# Altium schematic sheet Sheet_1_2024-01-19.schdoc
size 372 x 307 mm
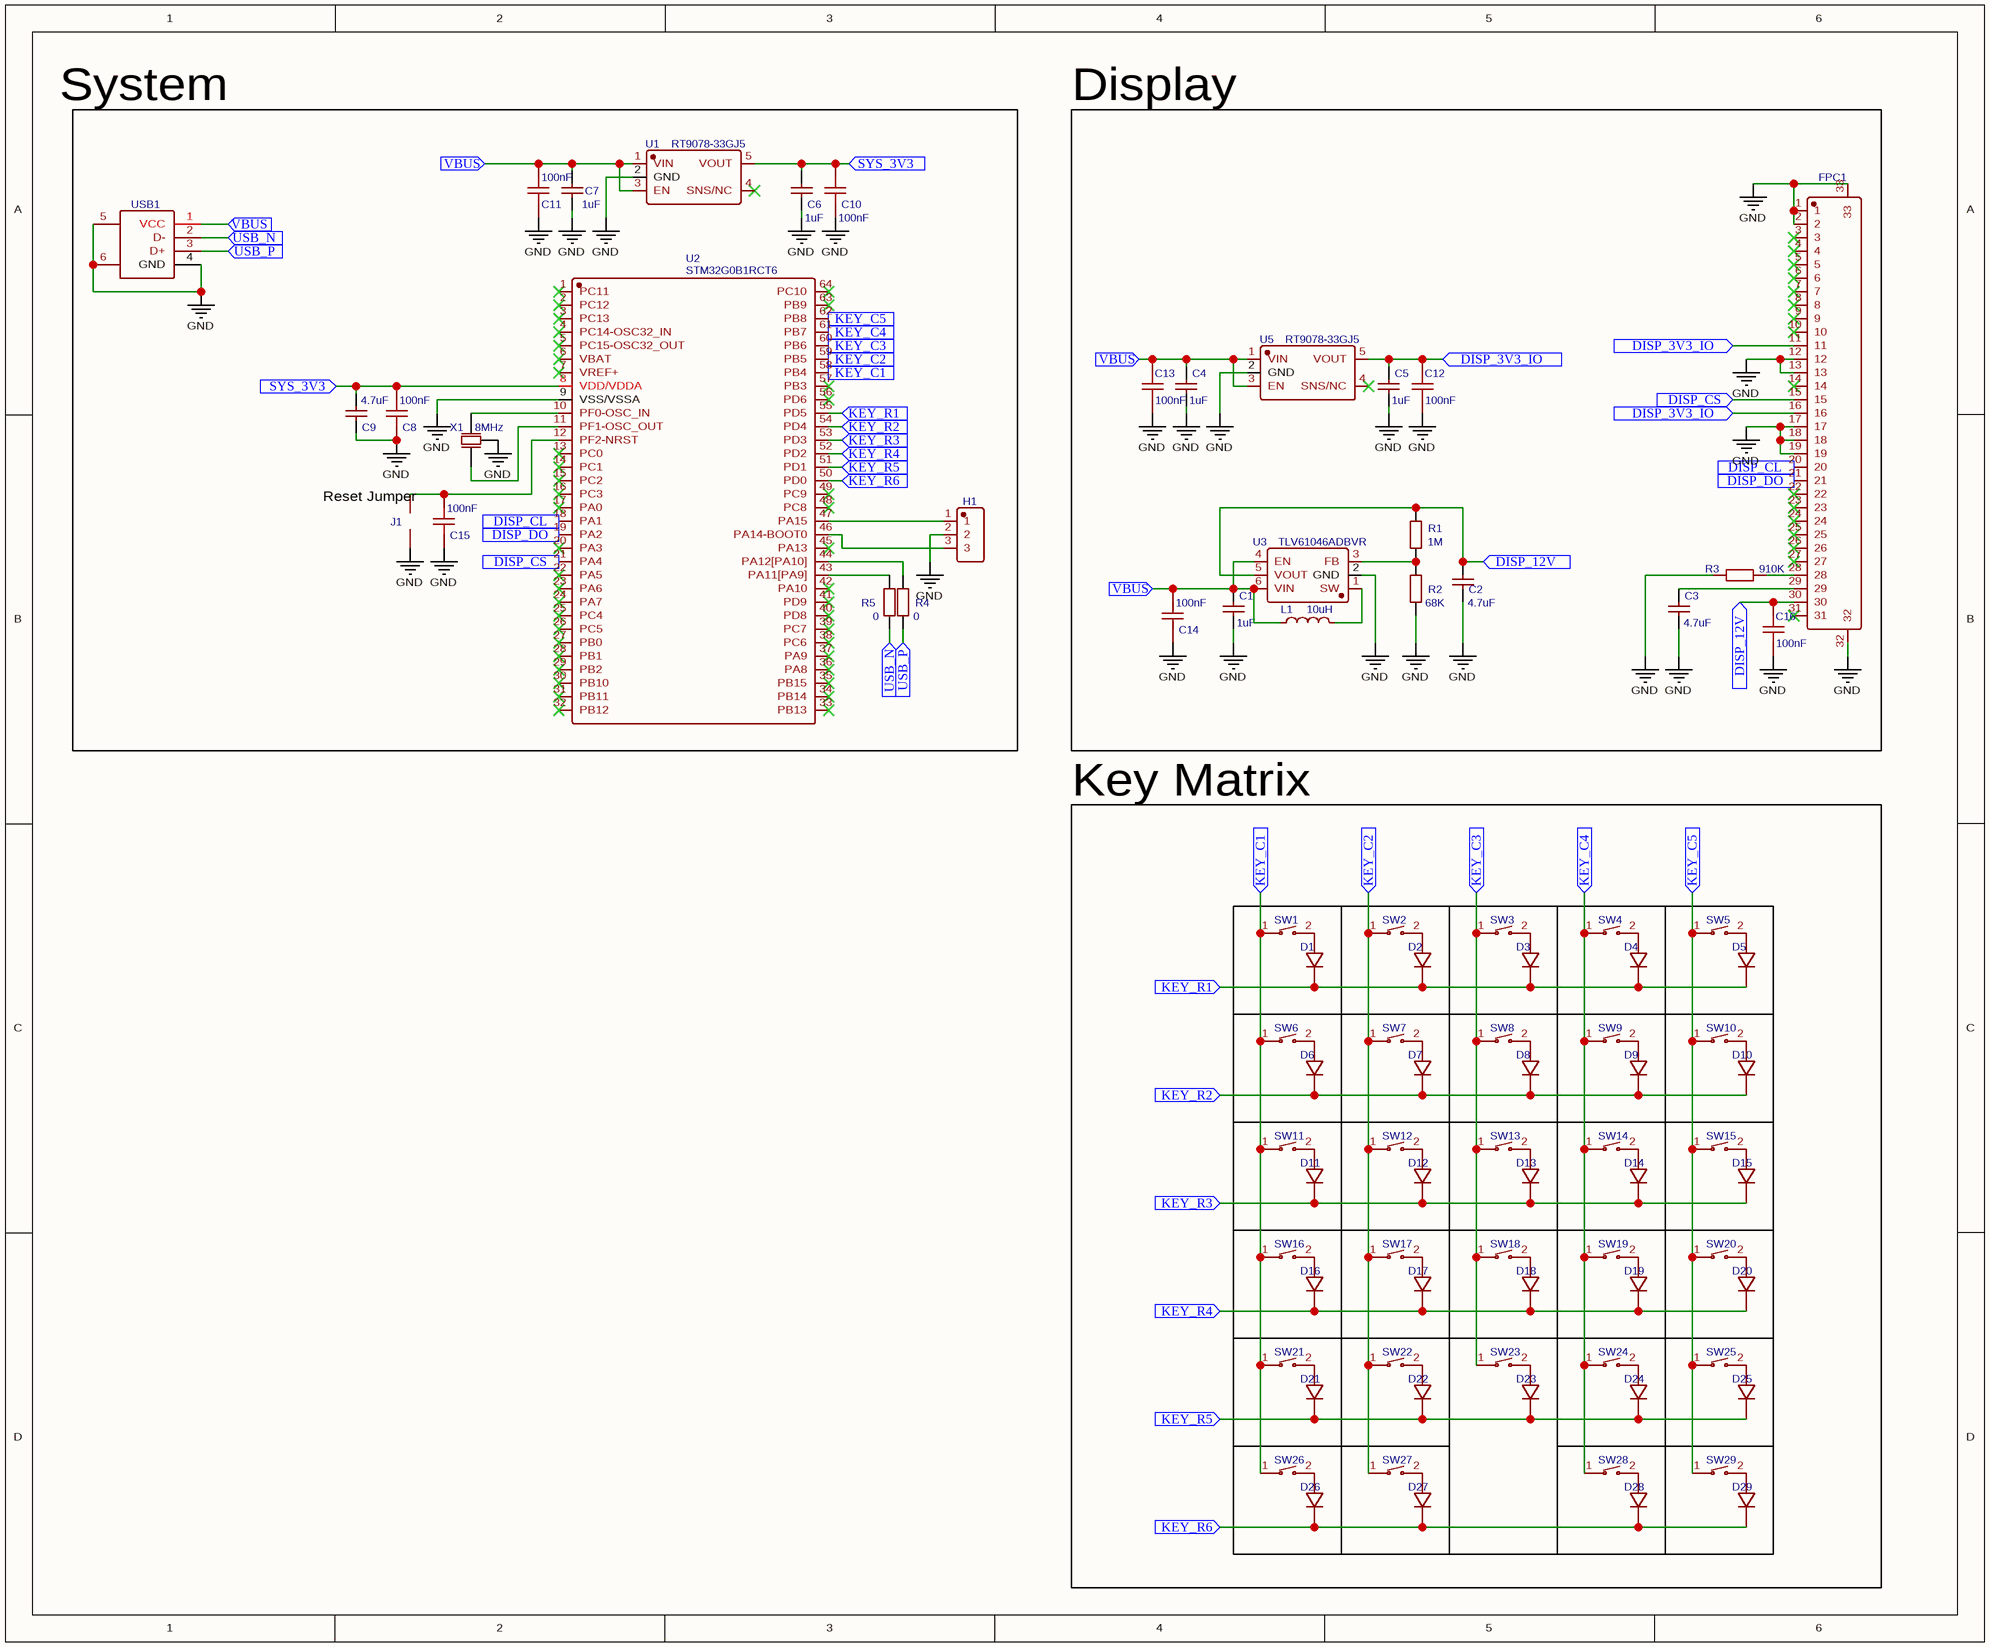
[diagram p0: Sheet_1_2024-01-19.schdoc]

## Parts
C1  1uF  [C0603]
C2  4.7uF  [C1206]
C3  4.7uF  [C1206]
C4  1uF  [C0603]
C5  1uF  [C0603]
C6  1uF  [C0603]
C7  1uF  [C0603]
C8  100nF  [C0603]
C9  4.7uF  [C1206]
C10  100nF  [C0603]
C11  100nF  [C0603]
C12  100nF  [C0603]
C13  100nF  [C0603]
C14  100nF  [C0603]
C15  100nF  [C0603]
C16  100nF  [C0603]
D1  1N4148TR-C84412  [DO-35_BD2.0-L4.2-P8.20-D0.5-RD]  (value not drawn)
D2  1N4148TR-C84412  [DO-35_BD2.0-L4.2-P8.20-D0.5-RD]  (value not drawn)
D3  1N4148TR-C84412  [DO-35_BD2.0-L4.2-P8.20-D0.5-RD]  (value not drawn)
D4  1N4148TR-C84412  [DO-35_BD2.0-L4.2-P8.20-D0.5-RD]  (value not drawn)
D5  1N4148TR-C84412  [DO-35_BD2.0-L4.2-P8.20-D0.5-RD]  (value not drawn)
D6  1N4148TR-C84412  [DO-35_BD2.0-L4.2-P8.20-D0.5-RD]  (value not drawn)
D7  1N4148TR-C84412  [DO-35_BD2.0-L4.2-P8.20-D0.5-RD]  (value not drawn)
D8  1N4148TR-C84412  [DO-35_BD2.0-L4.2-P8.20-D0.5-RD]  (value not drawn)
D9  1N4148TR-C84412  [DO-35_BD2.0-L4.2-P8.20-D0.5-RD]  (value not drawn)
D10  1N4148TR-C84412  [DO-35_BD2.0-L4.2-P8.20-D0.5-RD]  (value not drawn)
D11  1N4148TR-C84412  [DO-35_BD2.0-L4.2-P8.20-D0.5-RD]  (value not drawn)
D12  1N4148TR-C84412  [DO-35_BD2.0-L4.2-P8.20-D0.5-RD]  (value not drawn)
D13  1N4148TR-C84412  [DO-35_BD2.0-L4.2-P8.20-D0.5-RD]  (value not drawn)
D14  1N4148TR-C84412  [DO-35_BD2.0-L4.2-P8.20-D0.5-RD]  (value not drawn)
D15  1N4148TR-C84412  [DO-35_BD2.0-L4.2-P8.20-D0.5-RD]  (value not drawn)
D16  1N4148TR-C84412  [DO-35_BD2.0-L4.2-P8.20-D0.5-RD]  (value not drawn)
D17  1N4148TR-C84412  [DO-35_BD2.0-L4.2-P8.20-D0.5-RD]  (value not drawn)
D18  1N4148TR-C84412  [DO-35_BD2.0-L4.2-P8.20-D0.5-RD]  (value not drawn)
D19  1N4148TR-C84412  [DO-35_BD2.0-L4.2-P8.20-D0.5-RD]  (value not drawn)
D20  1N4148TR-C84412  [DO-35_BD2.0-L4.2-P8.20-D0.5-RD]  (value not drawn)
D21  1N4148TR-C84412  [DO-35_BD2.0-L4.2-P8.20-D0.5-RD]  (value not drawn)
D22  1N4148TR-C84412  [DO-35_BD2.0-L4.2-P8.20-D0.5-RD]  (value not drawn)
D23  1N4148TR-C84412  [DO-35_BD2.0-L4.2-P8.20-D0.5-RD]  (value not drawn)
D24  1N4148TR-C84412  [DO-35_BD2.0-L4.2-P8.20-D0.5-RD]  (value not drawn)
D25  1N4148TR-C84412  [DO-35_BD2.0-L4.2-P8.20-D0.5-RD]  (value not drawn)
D26  1N4148TR-C84412  [DO-35_BD2.0-L4.2-P8.20-D0.5-RD]  (value not drawn)
D27  1N4148TR-C84412  [DO-35_BD2.0-L4.2-P8.20-D0.5-RD]  (value not drawn)
D28  1N4148TR-C84412  [DO-35_BD2.0-L4.2-P8.20-D0.5-RD]  (value not drawn)
D29  1N4148TR-C84412  [DO-35_BD2.0-L4.2-P8.20-D0.5-RD]  (value not drawn)
FPC1  0.5K-AX-31PWB  [FPC-SMD_31P-P0.50_HDGC_0.5K-AX-31PWB]  (value not drawn)
H1  DZ254R-11-03-63  [HDR-TH_3P-P2.54-V-M]  (value not drawn)
J1  JUMPER_SOLDER_1X2  [JUMPER_SOLDER_1X2]  (value not drawn)
L1  10uH  [IND-SMD_L5.0-W5.0_LQH5BPBXX]
R1  1M  [R0603]
R2  68K  [R0603]
R3  910K  [R0603]
R4  0  [R0603]
R5  0  [R0603]
SW1  CPG151101D93  [SW-TH_CPG151101D9X]  (value not drawn)
SW2  CPG151101D93  [SW-TH_CPG151101D9X]  (value not drawn)
SW3  CPG151101D93  [SW-TH_CPG151101D9X]  (value not drawn)
SW4  CPG151101D93  [SW-TH_CPG151101D9X]  (value not drawn)
SW5  CPG151101D93  [SW-TH_CPG151101D9X]  (value not drawn)
SW6  CPG151101D93  [SW-TH_CPG151101D9X]  (value not drawn)
SW7  CPG151101D93  [SW-TH_CPG151101D9X]  (value not drawn)
SW8  CPG151101D93  [SW-TH_CPG151101D9X]  (value not drawn)
SW9  CPG151101D93  [SW-TH_CPG151101D9X]  (value not drawn)
SW10  CPG151101D93  [SW-TH_CPG151101D9X]  (value not drawn)
SW11  CPG151101D93  [SW-TH_CPG151101D9X]  (value not drawn)
SW12  CPG151101D93  [SW-TH_CPG151101D9X]  (value not drawn)
SW13  CPG151101D93  [SW-TH_CPG151101D9X]  (value not drawn)
SW14  CPG151101D93  [SW-TH_CPG151101D9X]  (value not drawn)
SW15  CPG151101D93  [SW-TH_CPG151101D9X]  (value not drawn)
SW16  CPG151101D93  [SW-TH_CPG151101D9X]  (value not drawn)
SW17  CPG151101D93  [SW-TH_CPG151101D9X]  (value not drawn)
SW18  CPG151101D93  [SW-TH_CPG151101D9X]  (value not drawn)
SW19  CPG151101D93  [SW-TH_CPG151101D9X]  (value not drawn)
SW20  CPG151101D93  [SW-TH_CPG151101D9X]  (value not drawn)
SW21  CPG151101D93  [SW-TH_CPG151101D9X]  (value not drawn)
SW22  CPG151101D93  [SW-TH_CPG151101D9X]  (value not drawn)
SW23  CPG151101D93  [SW-TH_CPG151101D9X]  (value not drawn)
SW24  CPG151101D93  [SW-TH_CPG151101D9X]  (value not drawn)
SW25  CPG151101D93  [SW-TH_CPG151101D9X]  (value not drawn)
SW26  CPG151101D93  [SW-TH_CPG151101D9X]  (value not drawn)
SW27  CPG151101D93  [SW-TH_CPG151101D9X]  (value not drawn)
SW28  CPG151101D93  [SW-TH_CPG151101D9X]  (value not drawn)
SW29  CPG151101D93  [SW-TH_CPG151101D9X]  (value not drawn)
U1  RT9078-33GJ5  [TSOT-23-5_L2.9-W1.6-P0.95-LS2.8-BR]
U2  STM32G0B1RCT6  [LQFP-64_L10.0-W10.0-P0.50-LS12.0-BL]
U3  TLV61046ADBVR  [SOT-23-6_L2.9-W1.6-P0.95-LS2.8-BL]
U5  RT9078-33GJ5  [TSOT-23-5_L2.9-W1.6-P0.95-LS2.8-BR]
USB1  U241-041N-1BR85-1  [USB-B-TH_U241-041N-1BR85-1]  (value not drawn)
X1  8MHz  [OSC-SMD_3P-L3.2-W1.3-P1.2-L]

## Blocks framed on the sheet
Reset Jumper: C6-C11 C15 H1 J1 R4 R5 U1 U2 USB1 X1
Display: C1-C5 C12-C14 C16 FPC1 L1 R1-R3 U3 U5
Key Matrix: D1-D29 SW1-SW29

## Ports
DISP_3V3_IO (in), DISP_12V (in), DISP_CL (in), DISP_CS (in), DISP_DO (in), KEY_C1 (in), KEY_C2 (in), KEY_C3 (in), KEY_C4 (in), KEY_C5 (in), KEY_R1 (in), KEY_R2 (in), KEY_R3 (in), KEY_R4 (in), KEY_R5 (in), KEY_R6 (in), SYS_3V3 (in), USB_N (in), USB_P (in), VBUS (in)

## Nets
GND: C1.1 C2.2 C3.2 C4.1 C5.1 C6.1 C7.1 C8.2 C9.2 C10.2 C11.2 C12.2 C13.2 C14.2 C15.2 C16.2 FPC1.1 FPC1.2 FPC1.12 FPC1.13 FPC1.17 FPC1.18 FPC1.19 FPC1.32 FPC1.33 H1.2 J1.1 R2.2 R3.1 U1.2(GND) U2.9(VSS/VSSA) U3.2(GND) U5.2(GND) USB1.4(GND) USB1.5(SH1) USB1.6(SH2) X1.2(GND)
DISP_3V3_IO: C5.2 C12.1 FPC1.11 FPC1.16 U5.5(VOUT) ; port DISP_3V3_IO
DISP_12V: C2.1 C16.1 FPC1.30 R1.1 U3.5(VOUT) ; port DISP_12V
DISP_CL: FPC1.20 U2.18(PA1) ; port DISP_CL
DISP_CS: FPC1.15 U2.21(PA4) ; port DISP_CS
DISP_DO: FPC1.21 U2.19(PA2) ; port DISP_DO
KEY_C1: SW1.1 SW6.1 SW11.1 SW16.1 SW21.1 SW26.1 U2.58(PB4) ; port KEY_C1
KEY_C2: SW2.1 SW7.1 SW12.1 SW17.1 SW22.1 SW27.1 U2.59(PB5) ; port KEY_C2
KEY_C3: SW3.1 SW8.1 SW13.1 SW18.1 SW23.1 U2.60(PB6) ; port KEY_C3
KEY_C4: SW4.1 SW9.1 SW14.1 SW19.1 SW24.1 SW28.1 U2.61(PB7) ; port KEY_C4
KEY_C5: SW5.1 SW10.1 SW15.1 SW20.1 SW25.1 SW29.1 U2.62(PB8) ; port KEY_C5
KEY_R1: D1.1(C) D2.1(C) D3.1(C) D4.1(C) D5.1(C) U2.55(PD5) ; port KEY_R1
KEY_R2: D6.1(C) D7.1(C) D8.1(C) D9.1(C) D10.1(C) U2.54(PD4) ; port KEY_R2
KEY_R3: D11.1(C) D12.1(C) D13.1(C) D14.1(C) D15.1(C) U2.53(PD3) ; port KEY_R3
KEY_R4: D16.1(C) D17.1(C) D18.1(C) D19.1(C) D20.1(C) U2.52(PD2) ; port KEY_R4
KEY_R5: D21.1(C) D22.1(C) D23.1(C) D24.1(C) D25.1(C) U2.51(PD1) ; port KEY_R5
KEY_R6: D26.1(C) D27.1(C) D28.1(C) D29.1(C) U2.50(PD0) ; port KEY_R6
SYS_3V3: C6.2 C8.1 C9.1 C10.1 U1.5(VOUT) U2.8(VDD/VDDA) ; port SYS_3V3
USB_N: R5.2 USB1.2(D-) ; port USB_N
USB_P: R4.2 USB1.3(D+) ; port USB_P
VBUS: C1.2 C4.2 C7.2 C11.1 C13.1 C14.1 L1.1 U1.1(VIN) U1.3(EN) U3.4(EN) U3.6(VIN) U5.1(VIN) U5.3(EN) USB1.1(VCC) ; port VBUS
NetC3_1: C3.1 FPC1.29
NetC15_1: C15.1 J1.2 U2.12(PF2-NRST)
NetD1_2: D1.2(A) SW1.2
NetD2_2: D2.2(A) SW2.2
NetD3_2: D3.2(A) SW3.2
NetD4_2: D4.2(A) SW4.2
NetD5_2: D5.2(A) SW5.2
NetD6_2: D6.2(A) SW6.2
NetD7_2: D7.2(A) SW7.2
NetD8_2: D8.2(A) SW8.2
NetD9_2: D9.2(A) SW9.2
NetD10_2: D10.2(A) SW10.2
NetD11_2: D11.2(A) SW11.2
NetD12_2: D12.2(A) SW12.2
NetD13_2: D13.2(A) SW13.2
NetD14_2: D14.2(A) SW14.2
NetD15_2: D15.2(A) SW15.2
NetD16_2: D16.2(A) SW16.2
NetD17_2: D17.2(A) SW17.2
NetD18_2: D18.2(A) SW18.2
NetD19_2: D19.2(A) SW19.2
NetD20_2: D20.2(A) SW20.2
NetD21_2: D21.2(A) SW21.2
NetD22_2: D22.2(A) SW22.2
NetD23_2: D23.2(A) SW23.2
NetD24_2: D24.2(A) SW24.2
NetD25_2: D25.2(A) SW25.2
NetD26_2: D26.2(A) SW26.2
NetD27_2: D27.2(A) SW27.2
NetD28_2: D28.2(A) SW28.2
NetD29_2: D29.2(A) SW29.2
NetFPC1_28: FPC1.28 R3.2
NetH1_1: H1.1 U2.47(PA15)
NetH1_3: H1.3 U2.46(PA14-BOOT0)
NetL1_2: L1.2 U3.1(SW)
NetR1_2: R1.2 R2.1 U3.3(FB)
NetR4_1: R4.1 U2.44(PA12[PA10])
NetR5_1: R5.1 U2.43(PA11[PA9])
NetU2_10: U2.10(PF0-OSC_IN) X1.1(OSC1)
NetU2_11: U2.11(PF1-OSC_OUT) X1.3(OSC2)

Not connected (* = marked no-connect by the designer): FPC1 3* 4* 5* 6* 7* 8* 9* 10* 14* 22* 23* 24* 25* 26* 27* 31*; U1 4(SNS/NC)*; U2 1(PC11)* 2(PC12)* 3(PC13)* 4(PC14-OSC32_IN)* 5(PC15-OSC32_OUT)* 6(VBAT)* 7(VREF+)* 13(PC0)* 14(PC1)* 15(PC2)* 16(PC3)* 17(PA0)* 20(PA3)* 22(PA5)* 23(PA6)* 24(PA7)* 25(PC4)* 26(PC5)* 27(PB0)* 28(PB1)* 29(PB2)* 30(PB10)* 31(PB11)* 32(PB12)* 33(PB13)* 34(PB14)* 35(PB15)* 36(PA8)* 37(PA9)* 38(PC6)* 39(PC7)* 40(PD8)* 41(PD9)* 42(PA10)* 45(PA13)* 48(PC8)* 49(PC9)* 56(PD6)* 57(PB3)* 63(PB9)* 64(PC10)*; U5 4(SNS/NC)*

## Notes on the sheet
- System

## Library data of the parts
C1 C4-C7 = 1uF: Manufacturer Part: CL10B105KO8NNNC; Manufacturer: SAMSUNG; nameAlias: Capacitance; Supplier: LCSC; Supplier Part: C59782; JLCPCB Part Class: Extended Part; spicePre: C; spiceSymbolName: CL10B105KO8NNNC
C2 C3 C9 = 4.7uF: Manufacturer Part: CL31B475KBHNNNE; Manufacturer: SAMSUNG(三星); nameAlias: Capacitance; Supplier: LCSC; Supplier Part: C51205; JLCPCB Part Class: Extended Part; spicePre: C; spiceSymbolName: CL31B475KBHNNNE
C8 C10-C16 = 100nF: Manufacturer: SAMSUNG(三星); Manufacturer Part: CL10B104KB8NNNC; nameAlias: Capacitance; Supplier: LCSC; Supplier Part: C1591; JLCPCB Part Class: Extended Part; spicePre: C; spiceSymbolName: CL10B104KB8NNNC
D1-D29 = 1N4148TR-C84412: Manufacturer: VISHAY; Supplier: LCSC; Manufacturer Part: 1N4148TR; Supplier Part: C84412; JLCPCB Part Class: Extended Part; spicePre: D; spiceSymbolName: 1N4148TR-C84412
FPC1 = 0.5K-AX-31PWB: Manufacturer: HDGC(华德共创); Contributor: LCSC; Supplier: LCSC; Supplier Part: C2911949; Manufacturer Part: 0.5K-AX-31PWB; JLCPCB Part Class: Extended Part; spicePre: F; spiceSymbolName: 0.5K-AX-31PWB
H1 = DZ254R-11-03-63: Manufacturer: DEALON(德艺隆); Contributor: LCSC; Supplier: LCSC; Supplier Part: C2935909; Manufacturer Part: DZ254R-11-03-63; JLCPCB Part Class: Extended Part; spicePre: H; spiceSymbolName: DZ254R-11-03-63
J1 = JUMPER_SOLDER_1X2: Contributor: DangerousPrototype; spicePre: J; spiceSymbolName: JUMPER_SOLDER_1X2
L1 = 10uH: Manufacturer: muRata(村田); Manufacturer Part: LQH5BPB100MT0L; nameAlias: Inductance; Contributor: LCSC; Supplier: LCSC; Supplier Part: C521243; JLCPCB Part Class: Extended Part; spicePre: L; spiceSymbolName: LQH5BPB100MT0L
R1 = 1M: Manufacturer: YAGEO; Manufacturer Part: RC0603JR-071ML; nameAlias: Resistance (Ohms); Resistance: 1MΩ; Supplier: LCSC; Supplier Part: C107698; JLCPCB Part Class: Extended Part; spicePre: R; spiceSymbolName: RC0603JR-071ML
R2 = 68K: Manufacturer: YAGEO; Manufacturer Part: RC0603JR-0768KL; nameAlias: Resistance (Ohms); Resistance: 68kΩ; Supplier: LCSC; Supplier Part: C113301; JLCPCB Part Class: Extended Part; spicePre: R; spiceSymbolName: RC0603JR-0768KL
R3 = 910K: Manufacturer: YAGEO; Manufacturer Part: RC0603JR-07910KL; nameAlias: Resistance (Ohms); Contributor: LCSC; Resistance: 910kΩ; Supplier: LCSC; Supplier Part: C141274; JLCPCB Part Class: Extended Part; spicePre: R; spiceSymbolName: RC0603JR-07910KL
R4 R5 = 0: Manufacturer: YAGEO; Manufacturer Part: RC0603JR-070RL; nameAlias: Resistance (Ohms); Resistance: 0Ω; Supplier: LCSC; Supplier Part: C95177; JLCPCB Part Class: Extended Part; spicePre: R; spiceSymbolName: RC0603JR-070RL
SW1-SW29 = CPG151101D93: Manufacturer: Kailh(凯华); Contributor: LCSC; Supplier: LCSC; Supplier Part: C400237; Manufacturer Part: CPG151101D93; JLCPCB Part Class: Extended Part; spicePre: S; spiceSymbolName: CPG151101D93
U1 U5 = RT9078-33GJ5: Manufacturer: Richtek Tech; Contributor: LCSC; Supplier: LCSC; Supplier Part: C110427; Manufacturer Part: RT9078-33GJ5; JLCPCB Part Class: Extended Part; spicePre: U; spiceSymbolName: RT9078-33GJ5
U2 = STM32G0B1RCT6: Manufacturer: ST(意法半导体); Contributor: lcsc; Supplier: LCSC; Supplier Part: C3034735; Manufacturer Part: STM32G0B1RCT6; link: https://atta.szlcsc.com/upload/public/pdf/source/20220610/AE51C760F8E597F032654332049C8E3A.pdf; JLCPCB Part Class: Extended Part; spicePre: U; spiceSymbolName: STM32G0B1RCT6
U3 = TLV61046ADBVR: Manufacturer: TI(德州仪器); Contributor: LCSC; Supplier: LCSC; Supplier Part: C464815; Manufacturer Part: TLV61046ADBVR; JLCPCB Part Class: Extended Part; spicePre: U; spiceSymbolName: TLV61046ADBVR
USB1 = U241-041N-1BR85-1: Manufacturer: XKB Enterprise; Contributor: LCSC; Supplier: LCSC; Supplier Part: C397338; Manufacturer Part: U241-041N-1BR85-1; JLCPCB Part Class: Extended Part; spicePre: U; spiceSymbolName: U241-041N-1BR85-1
X1 = 8MHz: Manufacturer: Murata Electronics; Manufacturer Part: CSTNE8M00G55A000R0; nameAlias: Frequency; Contributor: LCSC; Supplier: LCSC; Supplier Part: C341523; JLCPCB Part Class: Extended Part; spicePre: X; spiceSymbolName: CSTNE8M00G55A000R0